# EAGLE design quantizer_main (EAGLE 6.6.0)
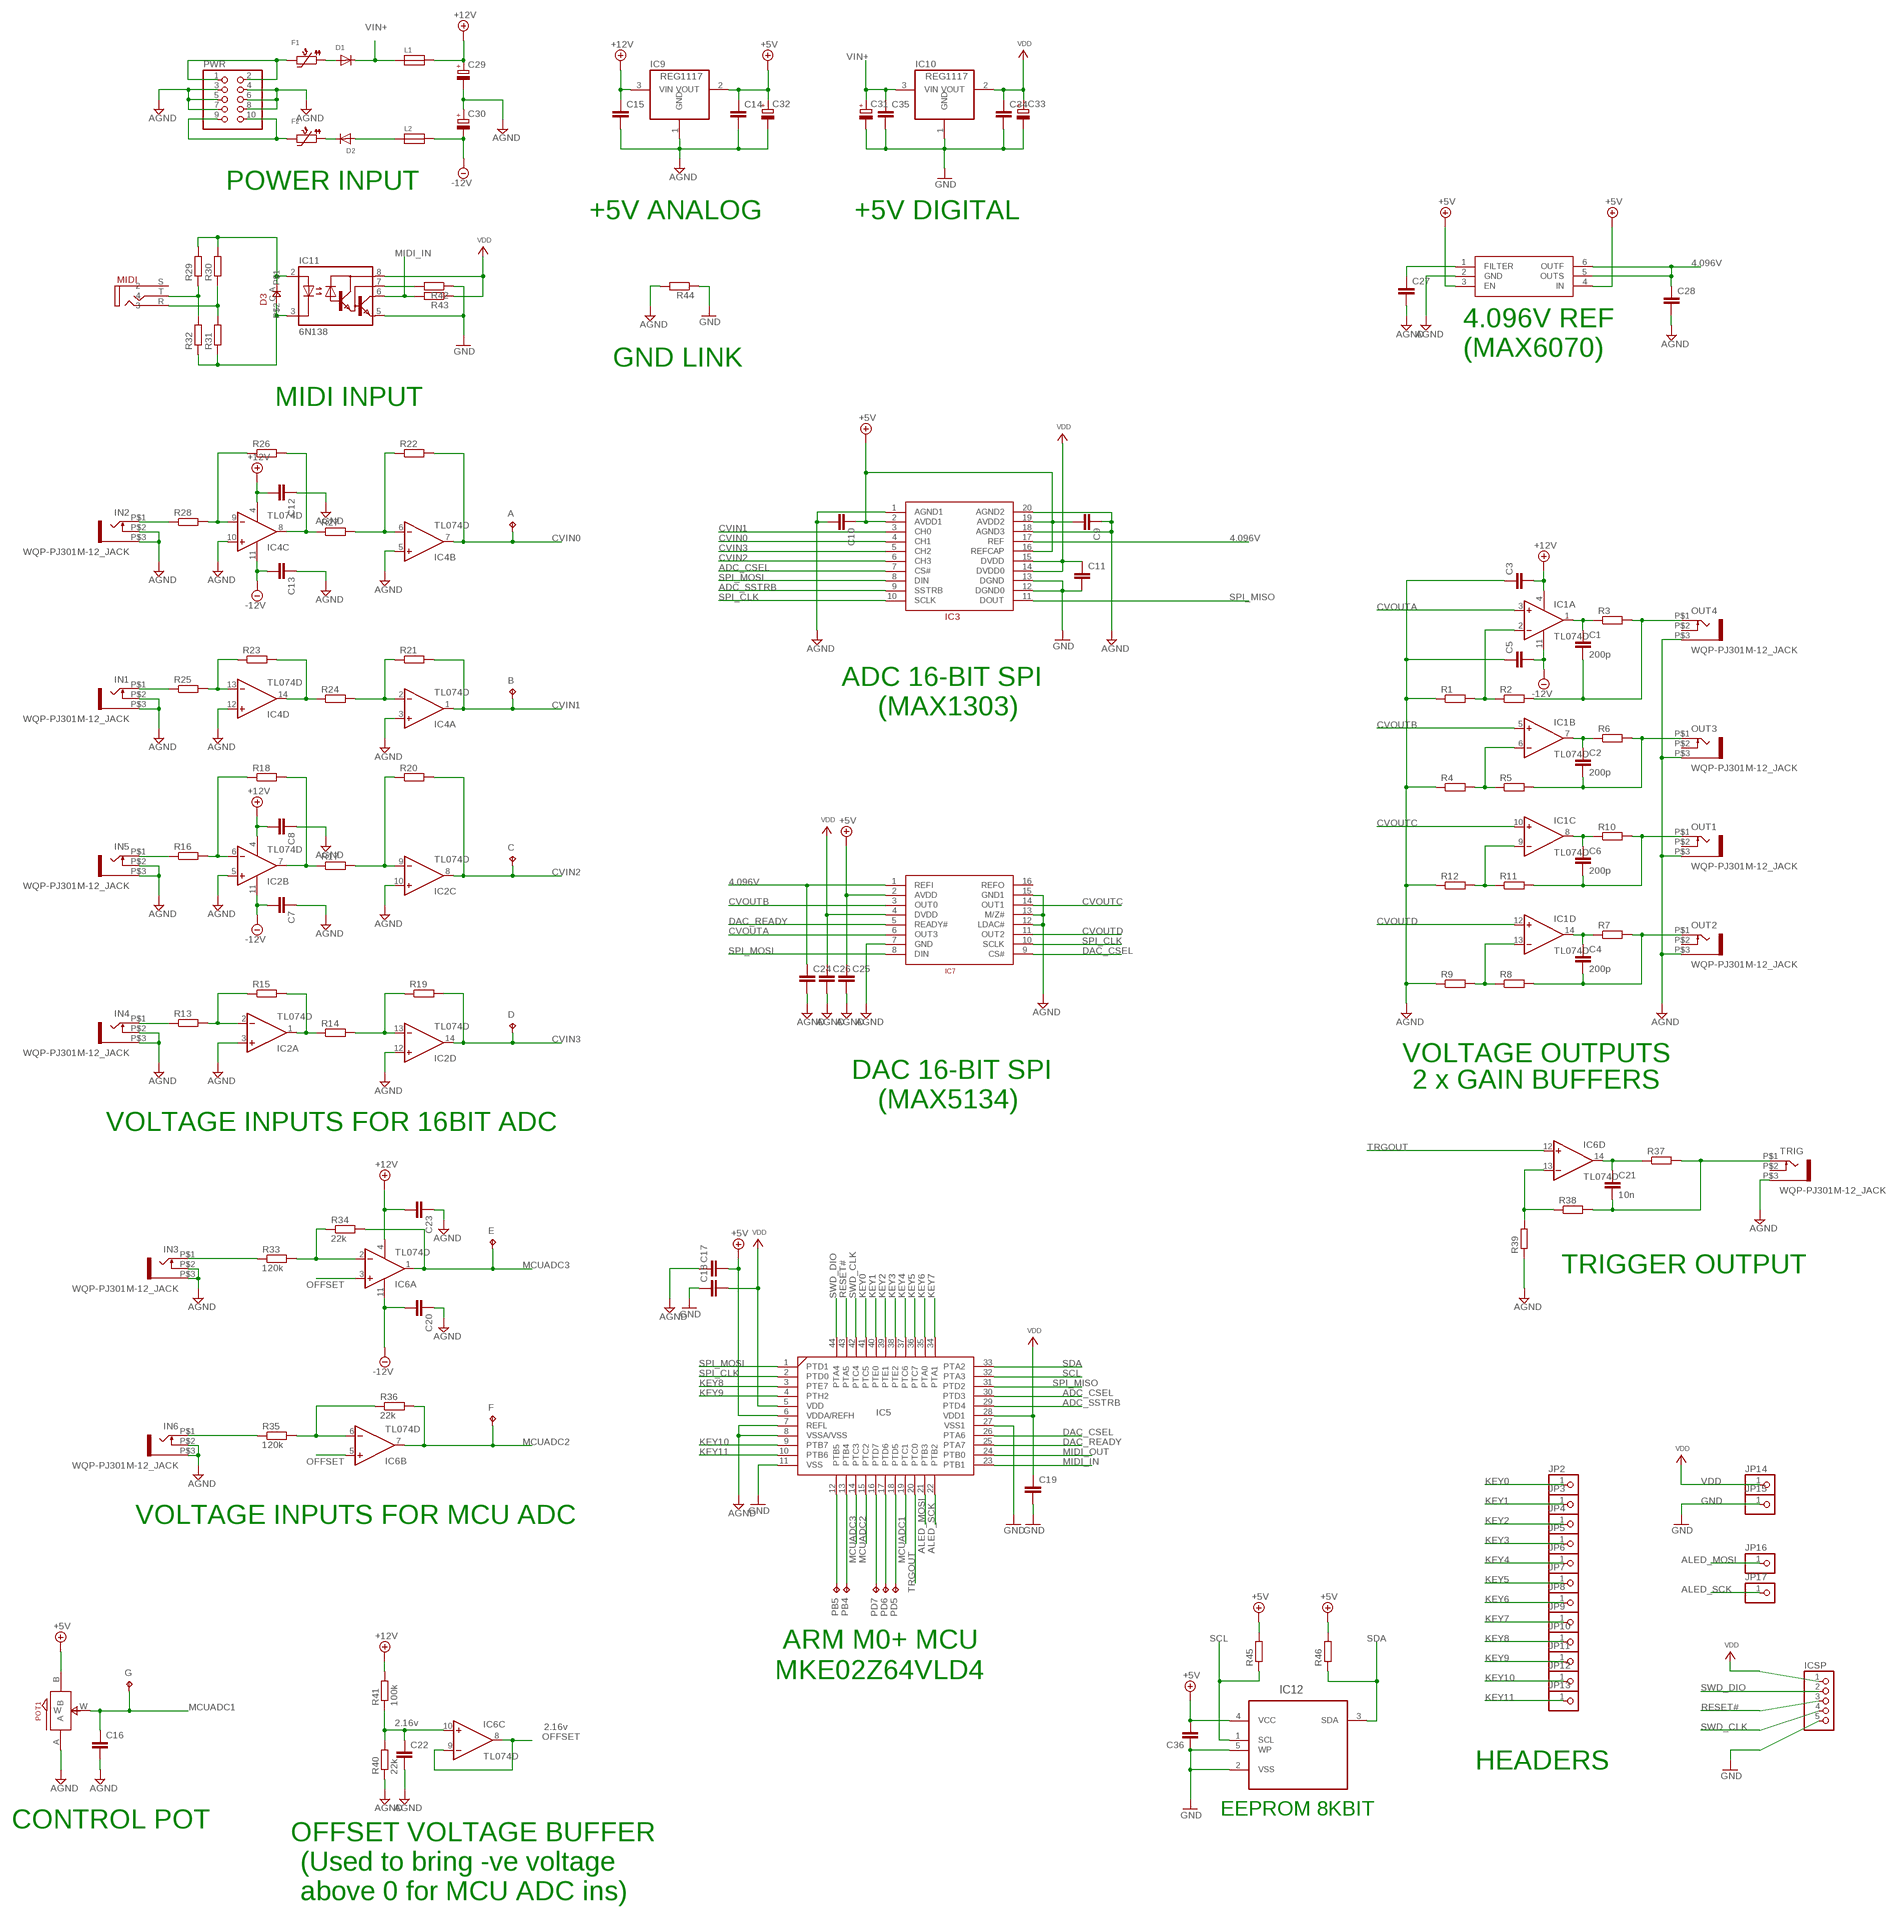
[diagram p0: schematic, sheet 1]

## Parts
A  TPB1,27  [B1,27]
B  TPB1,27  [B1,27]
C  TPB1,27  [B1,27]
C1  200p  C-EUC0805  [C0805]
C2  200p  C-EUC0805  [C0805]
C3  C-EUC0805  [C0805]
C4  200p  C-EUC0805  [C0805]
C5  C-EUC0805  [C0805]
C6  200p  C-EUC0805  [C0805]
C7  C-EUC0805  [C0805]
C8  C-EUC0805  [C0805]
C9  C-EUC0805  [C0805]
C10  C-EUC0805  [C0805]
C11  C-EUC0805  [C0805]
C12  C-EUC0805  [C0805]
C13  C-EUC0805  [C0805]
C14  C-EUC0805  [C0805]
C15  C-EUC0805  [C0805]
C16  C-EUC0805  [C0805]
C17  C-EUC0805  [C0805]
C18  C-EUC0805  [C0805]
C19  C-EUC0805  [C0805]
C20  C-EUC0805  [C0805]
C21  10n  C-EUC0805  [C0805]
C22  C-EUC0805  [C0805]
C23  C-EUC0805  [C0805]
C24  C-EUC0805  [C0805]
C25  C-EUC0805  [C0805]
C26  C-EUC0805  [C0805]
C27  C-EUC0805  [C0805]
C28  C-EUC0805  [C0805]
C29  CPOL-EUE2-5  [E2-5]
C30  CPOL-EUE2-5  [E2-5]
C31  CPOL-EUE2-5  [E2-5]
C32  CPOL-EUE2-5  [E2-5]
C33  CPOL-EUE2-5  [E2-5]
C34  C-EUC0805  [C0805]
C35  C-EUC0805  [C0805]
C36  C-EUC0805  [C0805]
D  TPB1,27  [B1,27]
D1  DIODESOD-123  [SOD-123]
D2  DIODESOD-123  [SOD-123]
D3  0805DIODE  [0805DIODE]
E  TPB1,27  [B1,27]
F  TPB1,27  [B1,27]
F1  PTC1206  [1206]
F2  PTC1206  [1206]
G  TPB1,27  [B1,27]
IC1  TL074D  [SO14]
IC2  TL074D  [SO14]
IC3  MAX1303_ADC  [TSSOP20]
IC4  TL074D  [SO14]
IC5  MKE02_44PIN  [TQFP44]
IC6  TL074D  [SO14]
IC7  MAX5134_DAC  [TSSOP16]
IC8  MAX6070  [SOT23-6]
IC9  REG1117  [SOT223]
IC10  REG1117  [SOT223]
IC11  6N138  [DIL08]
IC12  24LC_16BT-I/OT  [SOT95P290X145-5N]
ICSP  PINHD-1X5  [1X05]
IN1  WQP-PJ301M-12_JACK  [WQP-PJ301M-12_JACK]
IN2  WQP-PJ301M-12_JACK  [WQP-PJ301M-12_JACK]
IN3  WQP-PJ301M-12_JACK  [WQP-PJ301M-12_JACK]
IN4  WQP-PJ301M-12_JACK  [WQP-PJ301M-12_JACK]
IN5  WQP-PJ301M-12_JACK  [WQP-PJ301M-12_JACK]
IN6  WQP-PJ301M-12_JACK  [WQP-PJ301M-12_JACK]
JP2  PINHD-1X1  [1X01]
JP3  PINHD-1X1  [1X01]
JP4  PINHD-1X1  [1X01]
JP5  PINHD-1X1  [1X01]
JP6  PINHD-1X1  [1X01]
JP7  PINHD-1X1  [1X01]
JP8  PINHD-1X1  [1X01]
JP9  PINHD-1X1  [1X01]
JP10  PINHD-1X1  [1X01]
JP11  PINHD-1X1  [1X01]
JP12  PINHD-1X1  [1X01]
JP13  PINHD-1X1  [1X01]
JP14  PINHD-1X1  [1X01]
JP15  PINHD-1X1  [1X01]
JP16  PINHD-1X1  [1X01]
JP17  PINHD-1X1  [1X01]
L1  FERRITE  [0603]
L2  FERRITE  [0603]
MIDI  VERTICAL_3_5MM_SOCKETTHONK  [PJ301CM]
OUT1  WQP-PJ301M-12_JACK  [WQP-PJ301M-12_JACK]
OUT2  WQP-PJ301M-12_JACK  [WQP-PJ301M-12_JACK]
OUT3  WQP-PJ301M-12_JACK  [WQP-PJ301M-12_JACK]
OUT4  WQP-PJ301M-12_JACK  [WQP-PJ301M-12_JACK]
PB4  TPB1,27  [B1,27]
PB5  TPB1,27  [B1,27]
PD5  TPB1,27  [B1,27]
PD6  TPB1,27  [B1,27]
PD7  TPB1,27  [B1,27]
POT1  ALPS_POT_SMALL  [SMALL_ALPS_POT]
PWR  PINHD-2X5  [2X05]
R1  R-EU_R0805  [R0805]
R2  R-EU_R0805  [R0805]
R3  R-EU_R0805  [R0805]
R4  R-EU_R0805  [R0805]
R5  R-EU_R0805  [R0805]
R6  R-EU_R0805  [R0805]
R7  R-EU_R0805  [R0805]
R8  R-EU_R0805  [R0805]
R9  R-EU_R0805  [R0805]
R10  R-EU_R0805  [R0805]
R11  R-EU_R0805  [R0805]
R12  R-EU_R0805  [R0805]
R13  R-EU_R0805  [R0805]
R14  R-EU_R0805  [R0805]
R15  R-EU_R0805  [R0805]
R16  R-EU_R0805  [R0805]
R17  R-EU_R0805  [R0805]
R18  R-EU_R0805  [R0805]
R19  R-EU_R0805  [R0805]
R20  R-EU_R0805  [R0805]
R21  R-EU_R0805  [R0805]
R22  R-EU_R0805  [R0805]
R23  R-EU_R0805  [R0805]
R24  R-EU_R0805  [R0805]
R25  R-EU_R0805  [R0805]
R26  R-EU_R0805  [R0805]
R27  R-EU_R0805  [R0805]
R28  R-EU_R0805  [R0805]
R29  R-EU_R0805  [R0805]
R30  R-EU_R0805  [R0805]
R31  R-EU_R0805  [R0805]
R32  R-EU_R0805  [R0805]
R33  120k  R-EU_R0805  [R0805]
R34  22k  R-EU_R0805  [R0805]
R35  120k  R-EU_R0805  [R0805]
R36  22k  R-EU_R0805  [R0805]
R37  R-EU_R0805  [R0805]
R38  R-EU_R0805  [R0805]
R39  R-EU_R0805  [R0805]
R40  22k  R-EU_R0805  [R0805]
R41  100k  R-EU_R0805  [R0805]
R42  R-EU_R0805  [R0805]
R43  R-EU_R0805  [R0805]
R44  R-EU_R0805  [R0805]
R45  R-EU_R0805  [R0805]
R46  R-EU_R0805  [R0805]
TRIG  WQP-PJ301M-12_JACK  [WQP-PJ301M-12_JACK]

## Nets
4.096V: C24.1 C28.1 IC3.17(REF) IC7.1(REFI) IC8.5(OUTS) IC8.6(OUTF)
+5V: C9.2 C10.1 C14.1 C17.2 C25.1 C32.+ C36.2 IC3.2(AVDD1) IC3.16(REFCAP) IC3.19(AVDD2) IC5.6(VDDA/REFH) IC7.2(AVDD) IC8.3(EN) IC8.4(IN) IC9.2(VOUT) IC12.4(VCC) POT1.B R45.2 R46.2
+12V: C3.2 C8.2 C12.2 C15.1 C23.2 C29.+ IC1.4(P:V+) IC2.4(P:V+) IC4.4(P:V+) IC6.4(P:V+) IC9.3(VIN) L1.2 R41.2
-12V: C5.2 C7.2 C13.2 C20.2 C30.- IC1.11(P:V-) IC2.11(P:V-) IC4.11(P:V-) IC6.11(P:V-) L2.2
ADC_CSEL: IC3.7(CS#) IC5.30(PTD3)
ADC_SSTRB: IC3.9(SSTRB) IC5.29(PTD4)
AGND: C3.1 C5.1 C7.1 C8.1 C9.1 C10.2 C12.1 C13.1 C14.2 C15.2 C16.2 C17.1 C20.1 C22.2 C23.1 C24.2 C25.2 C26.2 C27.2 C28.2 C29.- C30.+ C32.- IC2.3(A:+IN) IC2.5(B:+IN) IC2.10(C:+IN) IC2.12(D:+IN) IC3.1(AGND1) IC3.18(AGND3) IC3.20(AGND2) IC4.3(A:+IN) IC4.5(B:+IN) IC4.10(C:+IN) IC4.12(D:+IN) IC5.7(REFL) IC5.8(VSSA/VSS) IC7.7(GND) IC7.12(LDAC#) IC7.13(M/Z#) IC7.15(GND1) IC8.2(GND) IC9.1(GND) IN1.P$2 IN1.P$3 IN2.P$2 IN2.P$3 IN3.P$2 IN3.P$3 IN4.P$2 IN4.P$3 IN5.P$2 IN5.P$3 IN6.P$2 IN6.P$3 OUT1.P$3 OUT2.P$3 OUT3.P$3 OUT4.P$3 POT1.A PWR.3 PWR.4 PWR.5 PWR.6 PWR.7 PWR.8 R1.1 R4.1 R9.1 R12.1 R39.1 R40.1 R44.2 TRIG.P$3
ALED_MOSI: IC5.21(PTB3) JP16.1
ALED_SCK: IC5.22(PTB2) JP17.1
CVIN0: A.TP IC3.4(CH1) IC4.7(B:OUT) R22.2
CVIN1: B.TP IC3.3(CH0) IC4.1(A:OUT) R21.2
CVIN2: C.TP IC2.8(C:OUT) IC3.6(CH3) R20.2
CVIN3: D.TP IC2.14(D:OUT) IC3.5(CH2) R19.2
CVOUTA: IC1.3(A:+IN) IC7.6(OUT3)
CVOUTB: IC1.5(B:+IN) IC7.3(OUT0)
CVOUTC: IC1.10(C:+IN) IC7.14(OUT1)
CVOUTD: IC1.12(D:+IN) IC7.11(OUT2)
DAC_CSEL: IC5.26(PTA6) IC7.9(CS#)
DAC_READY: IC5.25(PTA7) IC7.5(READY#)
GND: C11.2 C18.1 C19.2 C31.- C33.- C34.2 C35.2 C36.1 IC3.12(DGND0) IC3.13(DGND) IC5.11(VSS) IC5.27(VSS1) IC10.1(GND) IC11.5(GND) IC12.2(VSS) IC12.5(WP) ICSP.5 JP15.1 R42.1 R44.1
KEY0: IC5.41(PTC5) JP2.1
KEY1: IC5.40(PTE0) JP3.1
KEY2: IC5.39(PTE1) JP4.1
KEY3: IC5.38(PTE2) JP5.1
KEY4: IC5.37(PTC6) JP6.1
KEY5: IC5.36(PTC7) JP7.1
KEY6: IC5.35(PTA0) JP8.1
KEY7: IC5.34(PTA1) JP9.1
KEY8: IC5.3(PTE7) JP10.1
KEY9: IC5.4(PTH2) JP11.1
KEY10: IC5.9(PTB7) JP12.1
KEY11: IC5.10(PTB6) JP13.1
MCUADC1: C16.1 G.TP IC5.19(PTC1) POT1.W
MCUADC2: F.TP IC5.15(PTC2) IC6.7(B:OUT) R36.2
MCUADC3: E.TP IC5.14(PTC3) IC6.1(A:OUT) R34.2
MIDI_IN: IC5.23(PTB1) IC11.6(VO) R43.2
MIDI_OUT: IC5.24(PTB0)
N$1: IC1.2(A:-IN) R1.2 R2.1
N$2: C1.2 OUT4.P$1 R2.2 R3.2
N$3: D1.A F1.1
N$4: C1.1 IC1.1(A:OUT) R3.1
N$5: IN1.P$1 R25.1
N$6: IC1.6(B:-IN) R4.2 R5.1
N$7: C2.2 OUT3.P$1 R5.2 R6.2
N$8: C2.1 IC1.7(B:OUT) R6.1
N$9: D2.C F2.1
N$10: IN2.P$1 R28.1
N$11: IC1.9(C:-IN) R11.1 R12.2
N$12: C6.2 OUT1.P$1 R10.2 R11.2
N$13: C6.1 IC1.8(C:OUT) R10.1
N$14: F1.2 PWR.1 PWR.2
N$15: IC4.9(C:-IN) R26.1 R28.2
N$16: IC1.13(D:-IN) R8.1 R9.2
N$17: C4.2 OUT2.P$1 R7.2 R8.2
N$18: C4.1 IC1.14(D:OUT) R7.1
N$19: F2.2 PWR.9 PWR.10
N$20: IC4.8(C:OUT) R26.2 R27.1
N$21: IC4.6(B:-IN) R22.1 R27.2
N$22: IC5.12(PTB5) PB5.TP
N$23: IC11.7(VB) R42.2
N$24: MIDI.R R30.1 R31.2
N$25: IC4.13(D:-IN) R23.1 R25.2
N$26: IC4.14(D:OUT) R23.2 R24.1
N$27: IC4.2(A:-IN) R21.1 R24.2
N$28: MIDI.T R29.1 R32.2
N$29: D3.C IC11.3(C) R31.1 R32.1
N$30: IN5.P$1 R16.1
N$31: IC2.6(B:-IN) R16.2 R18.1
N$32: IC2.7(B:OUT) R17.1 R18.2
N$33: IC2.9(C:-IN) R17.2 R20.1
N$34: IC6.13(D:-IN) R38.1 R39.2
N$35: C21.1 IC6.14(D:OUT) R37.1
N$36: IN4.P$1 R13.1
N$37: IC2.2(A:-IN) R13.2 R15.1
N$38: IC2.1(A:OUT) R14.1 R15.2
N$39: IC2.13(D:-IN) R14.2 R19.1
N$40: C21.2 R37.2 R38.2 TRIG.P$1
N$41: D3.A IC11.2(A) R29.2 R30.2
N$42: C22.1 IC6.10(C:+IN) R40.2 R41.1
N$43: IC6.2(A:-IN) R33.2 R34.1
N$44: C27.1 IC8.1(FILTER)
N$45: IN3.P$1 R33.1
N$47: IC6.6(B:-IN) R35.2 R36.1
N$48: IC5.16(PTD7) PD7.TP
N$49: IN6.P$1 R35.1
N$51: IC5.17(PTD6) PD6.TP
N$52: IC5.18(PTD5) PD5.TP
N$58: IC5.13(PTB4) PB4.TP
OFFSET: IC6.3(A:+IN) IC6.5(B:+IN) IC6.8(C:OUT) IC6.9(C:-IN)
RESET#: IC5.43(PTA5) ICSP.3
SCL: IC5.32(PTA3) IC12.1(SCL) R45.1
SDA: IC5.33(PTA2) IC12.3(SDA) R46.1
SPI_CLK: IC3.10(SCLK) IC5.2(PTD0) IC7.10(SCLK)
SPI_MISO: IC3.11(DOUT) IC5.31(PTD2)
SPI_MOSI: IC3.8(DIN) IC5.1(PTD1) IC7.8(DIN)
SWD_CLK: IC5.42(PTC4) ICSP.4
SWD_DIO: IC5.44(PTA4) ICSP.2
TRGOUT: IC5.20(PTC0) IC6.12(D:+IN)
VDD: C11.1 C18.2 C19.1 C26.1 C33.+ C34.1 IC3.14(DVDD0) IC3.15(DVDD) IC5.5(VDD) IC5.28(VDD1) IC7.4(DVDD) IC10.2(VOUT) IC11.8(VCC) ICSP.1 JP14.1 R43.1
VIN+: C31.+ C35.1 D1.C IC10.3(VIN) L1.1
VIN-: D2.A L2.1
Unconnected: IC7.16(REFO) MIDI.S OUT1.P$2 OUT2.P$2 OUT3.P$2 OUT4.P$2 TRIG.P$2

## Notes on the sheet
- POWER INPUT
- +5V ANALOG | +5V DIGITAL
- 4.096V REF
- (MAX6070)
- GND LINK
- MIDI INPUT
- ADC 16-BIT SPI
- (MAX1303)
- VOLTAGE OUTPUTS
- DAC 16-BIT SPI
- 2 x GAIN BUFFERS
- (MAX5134)
- VOLTAGE INPUTS FOR 16BIT ADC
- TRIGGER OUTPUT
- VOLTAGE INPUTS FOR MCU ADC
- ARM M0+ MCU
- MKE02Z64VLD4
- 2.16v
- 2.16v
- HEADERS
- EEPROM 8KBIT
- CONTROL POT
- OFFSET VOLTAGE BUFFER
- (Used to bring -ve voltage 
  above 0 for MCU ADC ins)

## Library data of the parts
A B C D E F G PB4 PB5 PD5-PD7 = testpad:TP: Test pad
C1-C28 C34 C35 = rcl:C-EU: CAPACITOR, European symbol
C29-C33 = rcl:CPOL-EU: POLARIZED CAPACITOR, European symbol
C36 = resistor:C-EU: CAPACITOR, European symbol
D1 D2 = microbuilder:DIODE: Diode SMADIODE - SMA Surface Mount Package 20V 1A Schottky Diode Digikey (500mV @ 1A, 500uA Vr @ 20V): 641-1014-6-ND 10V 2A Schottky Diode Digikey (350mV @ 2A, 700uA Vr @ 10V): MBRA210LT3 SOD-123 30V 200mA (800mV Vf, 2uA Vr @ 25V) Schottky Diode (very fast switching for boost, etc.) - Digikey: BAT54T1GOSTR-ND 30V 500mA (430mV Vf, 130uA Vr @ 30V) Schottky Diode - Digikey: B0530W-FDICT-ND MBR120 1A 20V (0.34Vf) Schottky Diode - Digikey: MBR120VLSFT1GOSCT-ND SOD-323 10V 570mA (380mV Vf, 3ns) Schottky Diode - Digikey: ZLLS410CT-ND 1N4148WS - 75V 150mA (1V Vf @ 10mA, 4ns) Simple Diode - Digikey: 1N4148WSFSCT-ND, Mouser: 512-1N4148WS SOD-523 BAT54 30V 200mA Schottky (0.8 Vf @ 100mA, 5ns) - Digikey: BAT54XV2CT-ND 30V 30mA Schottky Diode (RB751S-40TE61) - Digikey: RB751S-40TE61CT-ND SOT23-R/W - SOT23 Package (R = Solder Paste/Reflow Ovens, W = Hand-Soldering) BAT54Film 40V 300mA - Digikey: 497-7162-1-ND DO-1N4148 Through Hole Small Current Diode (any model)
D3 = jasons_stuff:0805DIODE
F1 F2 = microbuilder:PTC: PTC (Resettable Fuse) 1206 Package 250mA PTC (16V Max, Time-to-Trip: 0.08s) - Digikey: F2110CT-ND 1210 Package 100mA PTC (30V Max, Time-to-Trip: 0.6s) - Digikey: MF-USMF010-2CT-ND 1812 Package 750mA PTC (24V Max, Time-to-Trip: 0.2s) - Digikey: MF-MSMF075/24-2CT-ND
IC1 IC2 IC4 IC6 = linear:TL074: OP AMP
IC3 = jason_eagle6:MAX1303_ADC
IC5 = jason_eagle6:MKE02_44PIN
IC7 = jason_eagle6:MAX5134_DAC
IC8 = jason_eagle6:MAX6070
IC9 IC10 = burr-brown:REG1117: 800mA and 1A Low Dropout (LDO) Positive Regulator 1.8V, 2.5V, 2.85V, 3.3V, 5V, and Adj; MPN: REG1117; OC_FARNELL: 1097566; OC_NEWARK: 14P6981
IC11 = optocoupler:6N138: MOTOROLA OPTO COUPLER; MF: VISHAY/TELEFUNKEN; MPN: 6N138; OC_FARNELL: 9860150; OC_NEWARK: 35K5294
IC12 = Microchip-24LCxxx:24LC_: IC, I2C Serial EEPROM,SOT-23-5; MPN: 24LC16BT-I/OT; OC_FARNELL: 9757961; OC_NEWARK: 62K0580; PACKAGE: SOT-23-5; SUPPLIER: MICROCHIP
ICSP = pinhead:PINHD-1X5: PIN HEADER
IN1-IN6 OUT1-OUT4 TRIG = thonkiconn:WQP-PJ301M-12_JACK
JP2-JP17 = pinhead:PINHD-1X1: PIN HEADER
L1 L2 = microbuilder:FERRITE: Ferrite Bead 0603 MMZ1608B121C - 120 Ohm, 600mA Ferrite Chip - Digikey: 445-2164-1-ND BK1608HW121-T - 120 Ohm, 600mA Ferrite Chip - Digikey: 587-1876-2-ND
MIDI = jason_eagle6:VERTICAL_3_5MM_SOCKET
POT1 = jasons_stuff:ALPS_POT_SMALL
PWR = pinhead:PINHD-2X5: PIN HEADER
R1-R46 = rcl:R-EU_: RESISTOR, European symbol

## Board
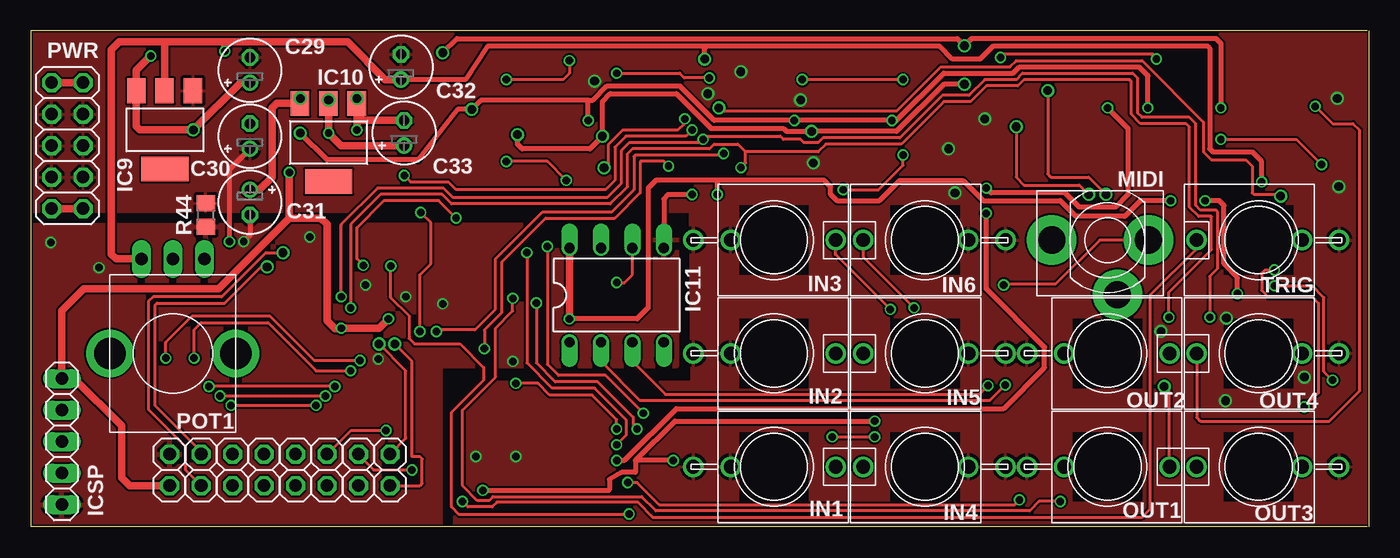
[diagram p1: board, top side]
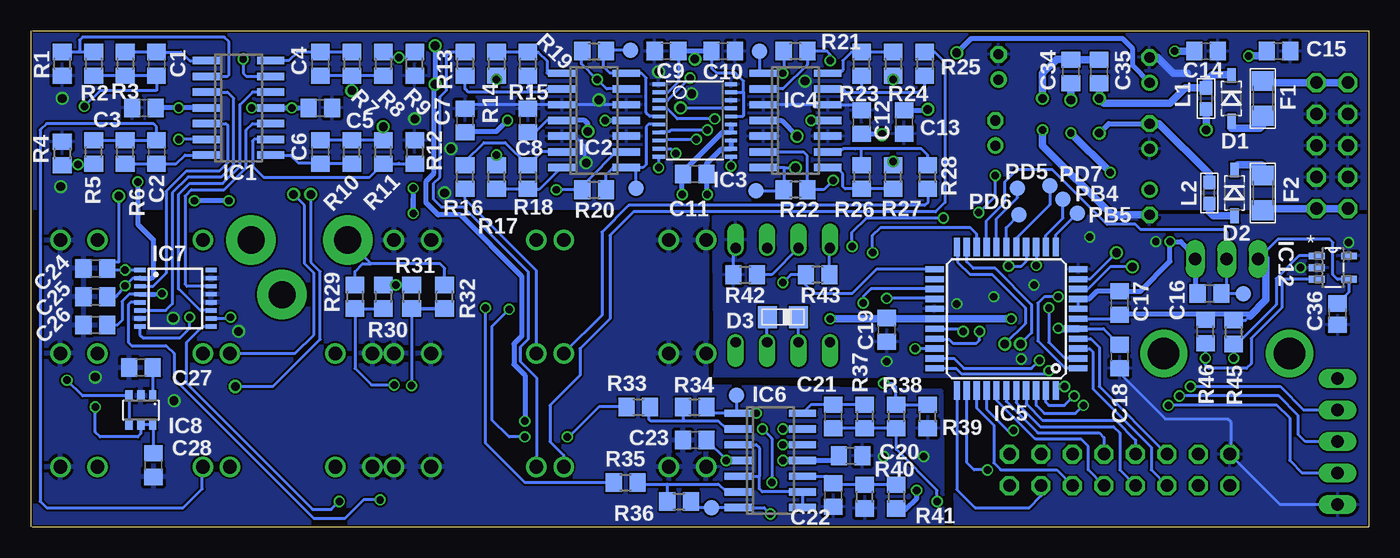
[diagram p2: board, bottom side, seen from below]

Size 107.95 x 39.98 mm. Coordinates in mm from the lower left corner, seen from the top.
Outline: 107.84,39.98 0,39.98 0,0 107.84,0
Outline: 107.95,39.98 107.95,0
Copper layers (1*16): Top 0.035mm / dielectric 1.5mm / Bottom 0.035mm
Design rules "hackvana": minimum track width 6mil, minimum drill 0.3mm, track to track 6mil, track to pad 9mil, pad to pad 6mil, via to via 6mil, smd to smd 0mil, copper to edge 6mil, drill to drill 6mil, minimum pad ring 10mil, minimum via ring 6mil, stop-mask expansion 2mil, vias tented up to drill 100mil, thermal gap 10mil

### Footprints (pad centres in the part's own frame; a part is rotated, then mirrored left to right if it is on the bottom)
B1,27 = smd 1.27 x 1.27: TP 0,0
C0805 = smd 1.3 x 1.5: 1 -0.95,0; 2 0.95,0
E2-5 = drill 0.813 pad 1.27: + -1.016,0 | drill 0.813 pad 1.27 octagon: - 1.016,0
C0805' = smd 1.3 x 1.5: 1 -0.85,0; 2 0.85,0
SOD-123 = smd 1.2 x 0.7: A 1.85,0; C -1.85,0
0805DIODE = smd 1.524 x 1.778: A -1.262,-0.005; C 1.238,-0.005
1206 = smd 1.6 x 1.8: 1 -1.4,0; 2 1.4,0
SO14 = smd 0.6 x 2.2: 1 -3.81,-2.6; 2 -2.54,-2.6; 3 -1.27,-2.6; 4 0,-2.6; 5 1.27,-2.6; 6 2.54,-2.6; 7 3.81,-2.6; 8 3.81,2.6; 9 2.54,2.6; 10 1.27,2.6; 11 0,2.6; 12 -1.27,2.6; 13 -2.54,2.6; 14 -3.81,2.6
TSSOP20 = smd 0.305 x 0.991: 1 -2.925,-2.918; 2 -2.275,-2.918; 3 -1.625,-2.918; 4 -0.975,-2.918; 5 -0.325,-2.918; 6 0.325,-2.918; 7 0.975,-2.918; 8 1.625,-2.918; 9 2.275,-2.918; 10 2.925,-2.918; 11 2.925,2.918; 12 2.275,2.918; 13 1.625,2.918; 14 0.975,2.918; 15 0.325,2.918; 16 -0.325,2.918; 17 -0.975,2.918; 18 -1.625,2.918; 19 -2.275,2.918; 20 -2.925,2.918
TQFP44 = smd 1.5 x 0.5: 1 -5.8,4; 2 -5.8,3.2; 3 -5.8,2.4; 4 -5.8,1.6; 5 -5.8,0.8; 6 -5.8,0; 7 -5.8,-0.8; 8 -5.8,-1.6; 9 -5.8,-2.4; 10 -5.8,-3.2; 11 -5.8,-4; 23 5.8,-4; 24 5.8,-3.2; 25 5.8,-2.4; 26 5.8,-1.6; 27 5.8,-0.8; 28 5.8,0; 29 5.8,0.8; 30 5.8,1.6; 31 5.8,2.4; 32 5.8,3.2; 33 5.8,4 | smd 0.5 x 1.5: 12 -4,-5.8; 13 -3.2,-5.8; 14 -2.4,-5.8; 15 -1.6,-5.8; 16 -0.8,-5.8; 17 0,-5.8; 18 0.8,-5.8; 19 1.6,-5.8; 20 2.4,-5.8; 21 3.2,-5.8; 22 4,-5.8; 34 4,5.8; 35 3.2,5.8; 36 2.4,5.8; 37 1.6,5.8; 38 0.8,5.8; 39 0,5.8; 40 -0.8,5.8; 41 -1.6,5.8; 42 -2.4,5.8; 43 -3.2,5.8; 44 -4,5.8
TSSOP16 = smd 0.9 x 0.35: 1 -2.875,2.275; 2 -2.875,1.625; 3 -2.875,0.975; 4 -2.875,0.325; 5 -2.875,-0.325; 6 -2.875,-0.975; 7 -2.875,-1.625; 8 -2.875,-2.275; 9 2.875,-2.275; 10 2.875,-1.625; 11 2.875,-0.975; 12 2.875,-0.325; 13 2.875,0.325; 14 2.875,0.975; 15 2.875,1.625; 16 2.875,2.275
SOT23-6 = smd 0.6 x 0.9: 1 -0.95,-1.15; 2 0,-1.15; 3 0.95,-1.15; 4 0.95,1.15; 5 0,1.15; 6 -0.95,1.15
SOT223 = smd 1.499 x 2.007: 1 -2.261,-3.15; 2 0.025,-3.15; 3 2.311,-3.15 | smd 3.81 x 2.007: 4 0,3.15
DIL08 = drill 0.813 offset: 1 -3.81,-3.81; 2 -1.27,-3.81; 3 1.27,-3.81; 4 3.81,-3.81; 5 3.81,3.81; 6 1.27,3.81; 7 -1.27,3.81; 8 -3.81,3.81
SOT95P290X145-5N = smd 1.27 x 0.559: 1 -1.295,0.94; 2 -1.295,0; 3 -1.295,-0.94; 4 1.295,-0.94; 5 1.295,0.94
1X05 = drill 1.016 long: 1 -5.08,0; 2 -2.54,0; 3 0,0; 4 2.54,0; 5 5.08,0
WQP-PJ301M-12_JACK = drill 1.1: P$1 0,5; P$2 0,-3.5; P$3 0,-6.5
1X01 = drill 1.016 octagon: 1 0,0
0603 = smd 1.1 x 1: 1 -0.85,0; 2 0.85,0
PJ301CM = drill 2.2 pad 4: R 0,3.3; S 4.4,0.8; T 0,-4.5
SMALL_ALPS_POT = drill 1.016 long: A -2.54,-7.62; B 2.54,-7.62; W 0,-7.62 | drill 2.54 pad 3.81: GND@1 -5.08,0; GND@2 5.08,0
2X05 = drill 1.016 octagon: 1 -5.08,-1.27; 2 -5.08,1.27; 3 -2.54,-1.27; 4 -2.54,1.27; 5 0,-1.27; 6 0,1.27; 7 2.54,-1.27; 8 2.54,1.27; 9 5.08,-1.27; 10 5.08,1.27
R0805 = smd 1.3 x 1.5: 1 -0.95,0; 2 0.95,0

### Placement (x,y rotation side)
A  49.42,27.11 0 bottom
B  49.17,38.35 0 bottom
C  59.14,27.3 0 bottom
C1  97.81,37.34 270 bottom
C2  97.81,30.23 90 bottom
C3  98.82,33.78 0 bottom
C4  84.6,37.34 270 bottom
C5  84.6,33.78 180 bottom
C6  84.6,30.23 90 bottom
C7  72.92,32.77 270 bottom
C8  67.84,32.77 270 bottom
C9  56.66,38.35 0 bottom
C10  52.09,38.35 0 bottom
C11  54.37,28.45 0 bottom
C12  40.91,32.64 270 bottom
C13  37.48,32.64 90 bottom
C14  13.1,38.35 0 bottom
C15  7.26,38.35 0 bottom
C16  12.85,18.8 180 bottom
C17  20.08,18.03 270 bottom
C18  20.08,13.72 90 bottom
C19  38.88,15.88 270 bottom
C20  41.8,5.72 180 bottom
C21  43.2,8.89 270 bottom
C22  43.2,2.54 270 bottom
C23  54.37,6.99 0 bottom
C24  102.76,20.83 180 bottom
C25  102.76,18.54 180 bottom
C26  102.76,16.26 180 bottom
C27  99.08,12.83 180 bottom
C28  98.06,4.95 270 bottom
C29  17.67,36.83 90 top
C30  17.67,31.5 90 top
C31  17.67,26.16 270 top
C32  29.86,37.08 90 top
C33  30.12,31.75 90 top
C34  24.02,36.7 90 bottom
C35  21.74,36.7 90 bottom
C36  [C0805']  2.49,17.14 90 bottom
D  59.58,38.42 0 bottom
D1  11.07,34.54 270 bottom
D2  10.81,26.92 270 bottom
D3  47.26,16.89 180 bottom
E  51.01,10.6 0 bottom
F  53.04,1.52 0 bottom
F1  8.53,34.54 90 bottom
F2  8.53,26.92 270 bottom
G  10.11,18.8 0 bottom
IC1  91.2,33.78 270 bottom
IC2  62.5,32.77 270 bottom
IC3  54.37,32.77 270 bottom
IC4  46.25,32.77 270 bottom
IC5  29.23,16.76 180 bottom
IC6  48.28,5.33 270 bottom
IC7  96.28,18.41 0 bottom
IC8  99.08,9.4 180 bottom
IC9  10.81,32 180 top
IC10  24.02,30.99 180 top
IC11  47.26,18.67 0 top
IC12  2.88,20.89 0 bottom
ICSP  2.49,6.86 270 top
IN1  59.96,4.83 270 top
IN2  59.96,13.97 270 top
IN3  59.96,23.11 270 top
IN4  72.15,4.83 90 top
IN5  72.15,13.97 90 top
IN6  72.15,23.11 90 top
JP2  18.81,5.84 90 top
JP3  18.81,3.3 90 top
JP4  21.35,5.84 90 top
JP5  21.35,3.3 90 top
JP6  23.89,5.84 90 top
JP7  23.89,3.3 90 top
JP8  26.43,5.84 90 top
JP9  26.43,3.3 90 top
JP10  16.27,3.3 90 top
JP11  16.27,5.84 90 top
JP12  13.73,5.84 90 top
JP13  13.73,3.3 90 top
JP14  11.19,3.3 90 top
JP15  11.19,5.84 90 top
JP16  28.97,5.84 90 top
JP17  28.97,3.3 90 top
L1  13.1,34.54 270 bottom
L2  12.85,26.92 90 bottom
MIDI  86.89,23.11 270 top
OUT1  86.89,4.83 270 top
OUT2  86.89,13.97 270 top
OUT3  99.08,4.83 90 top
OUT4  99.08,13.97 90 top
PB4  24.66,26.42 0 bottom
PB5  23.51,25.27 90 bottom
PD5  28.34,27.3 90 bottom
PD6  28.21,25.15 90 bottom
PD7  25.74,27.5 90 bottom
POT1  11.45,13.97 180 top
PWR  2.94,30.73 270 top
R1  105.43,37.34 90 bottom
R2  102.89,37.34 270 bottom
R3  100.35,37.34 270 bottom
R4  105.43,30.1 270 bottom
R5  102.89,30.23 90 bottom
R6  100.35,30.23 90 bottom
R7  82.06,37.34 270 bottom
R8  79.52,37.34 270 bottom
R9  76.98,37.34 90 bottom
R10  82.06,30.23 90 bottom
R11  79.52,30.23 90 bottom
R12  76.98,30.23 270 bottom
R13  72.92,37.34 270 bottom
R14  70.38,37.34 270 bottom
R15  67.84,37.34 90 bottom
R16  72.92,28.19 90 bottom
R17  70.38,28.19 90 bottom
R18  67.84,28.19 270 bottom
R19  62.5,38.35 0 bottom
R20  62.5,27.18 0 bottom
R21  46.25,38.35 180 bottom
R22  46.25,27.18 180 bottom
R23  40.91,37.34 90 bottom
R24  38.37,37.34 270 bottom
R25  35.83,37.34 270 bottom
R26  40.91,28.19 270 bottom
R27  38.37,28.19 90 bottom
R28  35.58,28.19 90 bottom
R29  81.81,18.54 270 bottom
R30  79.52,18.54 270 bottom
R31  77.23,18.54 90 bottom
R32  74.57,18.54 90 bottom
R33  58.95,9.65 0 bottom
R34  54.37,9.65 0 bottom
R35  59.96,3.56 0 bottom
R36  55.64,2.03 0 bottom
R37  40.66,8.89 270 bottom
R38  38.12,8.89 270 bottom
R39  35.58,8.89 90 bottom
R40  40.66,2.41 90 bottom
R41  38.12,2.41 270 bottom
R42  50.31,20.32 0 bottom
R43  44.47,20.32 180 bottom
R44  14.12,25.15 90 top
R45  10.88,15.68 90 bottom
R46  13.16,15.75 90 bottom
TRIG  99.08,23.11 90 top

### Tracks (layer width: path | path; a pad name or v marks a point on that pad's centre or on a via)
4.096V  (via drill 0.6, 0.7)
  Top 0.254: v100.35,20.7 99.59,20.7 99.33,20.45 99.33,19.05 99.84,18.54 103.4,18.54 103.9,18.03 103.9,10.8 v102.76,9.65 | v100.86,26.67 100.73,26.8 98.7,26.8 98.57,26.92 98.57,29.08 98.06,29.59 95.27,29.59 94.63,30.23 94.63,32.64 89.68,37.59 79.52,37.59 79.01,37.08 73.42,37.08 69.87,33.53 55.77,33.53 v55.52,33.78
  Bottom 0.254: v100.35,20.7 100.21,20.69 IC7.1 101.67,20.69 C24.1 101.3,21.34 100.86,21.34 v100.86,26.67 | IC8.6 | C28.1 98.06,8.18 IC8.6 | IC8.6 IC8.5 99.08,7.49 99.33,7.24 102.38,7.24 102.76,7.62 v102.76,9.65 | IC3.17 55.48,33.74 v55.52,33.78
+5V  (via drill 0.6, 0.7)
  Top 0.254: v100.35,19.43 103.4,19.43 104.35,18.48 104.35,12.51 v105.05,11.81
  Top 0.406: v99.33,27.81 99.33,29.46 98.57,30.23 95.4,30.23 95.14,30.48 95.14,38.61 95.01,38.73 77.62,38.73 76.6,37.72 74.38,37.72 73.36,38.73 54.5,38.73 | v54.37,37.72 54.37,38.61 54.5,38.73 | 54.5,38.73 36.85,38.73 35.07,36.07 C32.+
  Top 0.61: C32.+ 28.59,36.07 25.55,39.12 15.77,39.12 | IC9.2 10.79,39.01 10.69,39.12 | 15.77,39.12 10.69,39.12 | 10.69,39.12 7.13,39.12 6.5,38.48 6.5,21.97 6.88,21.59 POT1.B | v15.64,38.35 15.64,38.99 15.77,39.12
  Bottom 0.254: IC3.19 50.45,35.04 50.44,35.05 | 50.44,35.05 50.44,33.15 50.49,33.09 IC3.16 | C25.1 101.11,18.54 v100.35,19.43 99.74,20.04 IC7.2 | IC8.4 IC8.3 103.78,10.55 v105.05,11.81 | IC3.2 56.54,35.04 55.64,35.94 55.64,38.29 C9.2 | 50.44,35.05 50.44,35.94 51.07,36.58 52.6,36.58 52.98,36.96 52.98,38.29 C10.1 | IC5.6 20.4,16.76 C17.2 | C36.2 1.58,18.91 IC12.4 2.51,19.95 2.88,20.32 2.88,22.92 3.13,23.18 7.32,23.18 POT1.B | R45.2 9.93,16.63 9.58,16.99 9.42,17.14 | R46.2 13.16,17.02 13.04,17.14
  Bottom 0.305: C17.2 19.9,17.08 19.58,16.76
  Bottom 0.406: IC7.2 98.22,20.04 98.06,20.19 98.06,23.11 99.33,24.38 v99.33,27.81 | C10.1 54.37,38.35 | 54.37,38.35 C9.2 | v54.37,37.72 54.37,38.35 | 9.42,17.14 13.04,17.14 19.84,17.14 19.9,17.08
  Bottom 0.61: C14.1 v15.64,38.35 | C17.2 20.08,16.89 | POT1.B 8.34,21.59 8.27,21.65 8.27,18.29 9.58,16.99
+12V  (via drill 0.6, 0.7)
  Top 0.406: v96.03,33.78 96.03,38.99 95.65,39.37 75.9,39.37 v75.33,38.8 74.76,39.37 34.37,39.37 v33.23,38.23 | v39.26,31.62 39.26,30.86 39.64,30.48 45.1,30.48 v46.12,31.5 46.12,34.29 46.75,34.92 52.09,34.92 54.88,32.13 60.72,32.13 60.98,31.88 v63.01,31.88 69.87,31.88 73.68,35.69 v75.33,35.69 | v68.09,8.51 51.96,8.51 48.79,5.33 | v36.47,2.92 46.63,2.92 46.69,2.99 46.69,3.81 47.64,4.38 48.79,4.38 48.79,5.33 | v51.83,5.33 48.79,5.33
  Top 0.61: C29.+ 16.91,35.81 v13.1,32 8.78,32 8.5,32.28 IC9.3 8.5,36.8 v9.67,37.97
  Bottom 0.254: IC2.4 66.31,32.77 67.07,32 67.65,32 C8.2 | 38.06,1.52 R41.2 38.05,1.4 | IC6.4 51.77,5.33 C23.2
  Bottom 0.406: C3.2 v96.03,33.78 IC1.4 | C29.+ 19.07,37.21 19.07,38.61 19.83,39.37 32.09,39.37 v33.23,38.23 | IC4.4 47.39,32.77 v46.12,31.5 | C12.2 39.33,31.69 v39.26,31.62 | v75.33,38.8 v75.33,35.69 75.46,35.56 75.46,28.45 76.09,27.81 76.09,26.16 75.08,25.15 73.3,25.15 68.34,20.19 68.34,15.37 68.98,14.73 68.98,13.08 68.09,12.19 v68.09,8.51 | v63.01,31.88 63.01,32.51 63.26,32.77 IC2.4 | IC6.4 v51.83,5.33 | 38.05,1.4 37.36,1.4 36.47,2.29 v36.47,2.92
  Bottom 0.61: L1.2 v13.1,32 | C15.1 8.21,38.04 8.27,37.97 v9.67,37.97
-12V  (via drill 0.6, 0.7)
  Top 0.406: v90.14,33.78 90.14,36.37 89.43,37.08 79.77,37.08 79.27,36.58 73.68,36.58 69.87,32.77 v69.49,32.77 v61.61,32.77 55.14,32.77 52.34,35.56 46.5,35.56 45.36,34.42 44.98,34.42 | v21.74,31.75 23.89,29.59 31.26,29.59 34.44,33.66 v35.58,33.66 36.34,34.42 44.98,34.42 | v44.98,32.77 44.98,34.42 | v77.11,25.27 77.11,19.18 81.81,14.48 81.81,12.83 78.5,9.53 52.09,9.53 47.9,5.33 v47.26,5.33 | v86.9,33.78 86.9,33.77 88.54,32.13 88.54,26.8 87.52,25.78 84.6,25.78 83.46,26.92 77.49,26.92 v77.11,27.3
  Bottom 0.254: 72.86,31.88 C7.2
  Bottom 0.406: C20.2 43.13,5.33 IC6.11 v47.26,5.33 | 72.86,31.88 70.38,31.88 v69.49,32.77 | v61.61,32.77 IC2.11 | C5.2 v86.9,33.78 IC1.11 v90.14,33.78 | v21.74,31.75 20.97,32.51 C30.- | v44.98,32.77 IC4.11 | C13.2 35.64,33.59 v35.58,33.66 | v77.11,27.3 v77.11,25.27 77.11,26.54
  Bottom 0.61: C30.- 16.91,32.51 12.85,28.45 L2.2
ADC_CSEL  (via drill 0.6)
  Top 0.254: v53.36,32 52.85,31.5 48.02,31.5 47.14,30.61 47.14,27.94 46.37,27.18 34.31,27.18 33.67,27.81 30.63,27.81 v30.12,28.32 | v31.39,15.75 31.39,20.32 32.28,21.21 32.28,24.51 v31.45,25.34
  Bottom 0.254: IC5.30 34.98,15.11 33.86,15.11 33.55,14.8 31.64,14.8 31.39,15.05 v31.39,15.75 | IC3.7 57.21,31.88 56.41,31.88 56.28,32 v53.36,32 | v30.12,28.32 30.12,26.67 v31.45,25.34
ADC_SSTRB  (via drill 0.6)
  Top 0.254: v55.9,30.1 55.77,29.97 48.79,29.97 48.66,29.84 48.66,27.18 46.88,25.4 41.29,25.4 37.48,21.59 37.48,17.53 35.83,15.88 32.85,15.88 v32.72,15.75
  Bottom 0.254: 34.94,15.88 IC5.29 32.94,15.96 v32.72,15.75 | IC3.9 57.28,30.48 56.28,30.48 v55.9,30.1
AGND  (via drill 0.6, 0.7)
  Top 0.406: v16.02,22.99 16.02,28.83 C30.+
  Bottom 0.254: 41.23,34.04 IC4.12 IC4.3 | C7.1 72.6,34.04 68.09,34.04 67.84,33.78 C8.1 67.52,34.04 IC2.3 62.5,34.04 | IC2.12 62.5,34.04 | 62.49,34.02 62.5,34.04 | IC5.7 IC5.8 | IC2.5 64.03,31.5 63.26,30.73 63.26,29.46 v63.14,29.34 | C16.2 13.99,18.8
  Bottom 0.406: IC5.8 22.55,18.36 21.93,18.98 C17.1 18.44,18.98 16.02,21.4 v16.02,22.99 15.13,22.99 13.99,21.84 POT1.A 13.99,18.99 C16.2
  Bottom 0.61: C29.- 17.04,37.85 15.77,36.58 14.62,36.58
  other vias: 57.3,36.7 62.12,34.42 54.63,34.92 45.48,35.94 105.56,27.43 105.43,34.54 96.41,10.16 102.76,12.06 96.47,16.83 76.98,32.89 74.06,30.48 91.2,15.75 74.57,26.92 39.13,5.65 35.9,5.65
  pour Bottom: -1.12,40.01 -1.25,25.65 107.84,25.65 107.97,40.01
  pour Bottom: 34.31,0.19 34.37,10.48 34.44,10.99 63.52,11.56 63.71,-0.13
  pour Bottom: 107.84,0 53.49,0.06 53.36,29.46 104.09,29.34 107.9,29.4 107.97,0.19
  pour Top: 34.31,11.68 53.36,11.68 53.23,25.4 -1.38,25.4 -1.51,40.01 107.97,39.94 107.97,-0.13 34.18,-0.06
ALED_MOSI  (via drill 0.7 pad 0.61)
  Top 0.254: JP16.1 30.24,7.11 30.24,12.57 v28.09,14.73
  Bottom 0.254: 32.4,22.54 IC5.21 32.43,21.36 31.9,20.83 30.12,20.83 27.2,17.91 27.2,15.62 v28.09,14.73
ALED_SCK  (via drill 0.7 pad 0.61)
  Top 0.254: JP17.1 31.39,3.3 31.58,3.49 31.58,5.46 31.39,5.65 30.75,5.65 30.75,13.34 v29.36,14.73
  Bottom 0.254: IC5.22 33.17,22.5 33.17,21.34 32.15,20.32 30.37,20.32 27.7,17.65 27.7,16.38 v29.36,14.73
CVIN0  (via drill 0.6, 0.7 pad 0.61)
  Top 0.254: v46.25,28.96 46.63,29.34 46.63,30.86 47.77,32 52.22,32 52.77,32.56 v52.77,32.89
  Bottom 0.254: R22.2 46.88,27.49 47.14,27.75 47.14,28.96 | IC3.4 56.62,33.74 55.77,32.89 v52.77,32.89 | 47.26,27.24 R22.2 | 47.14,28.96 v46.25,28.96 | 47.14,28.96 IC4.7 | A.TP 47.26,27.11 R22.2
CVIN1  (via drill 0.6)
  Top 0.254: v47.26,36.58 52.34,36.58 52.72,36.2 v54.76,36.2
  Bottom 0.254: R21.2 47.2,36.64 v47.26,36.58 IC4.1 49.17,36.9 B.TP | IC3.3 56.56,34.39 v54.76,36.2
CVIN2
  Bottom 0.254: R20.2 61.55,28.38 60.98,28.96 IC2.8 59.14,28.96 | IC3.6 58.13,32.44 58.31,32.26 58.31,29.21 58.57,28.96 59.14,28.96 | C.TP 59.14,28.96
CVIN3
  Bottom 0.254: IC3.5 58,33.09 58.31,33.4 58.31,36.2 58.69,36.58 IC2.14 61.23,36.58 61.74,37.08 61.74,38.17 R19.2 61.49,38.42 D.TP
CVOUTA
  Bottom 0.254: IC1.3 92.09,35.05 91.59,34.54 91.59,29.21 92.6,28.19 95.27,28.19 96.54,26.92 96.54,17.97 97.07,17.44 IC7.6
CVOUTB
  Bottom 0.254: IC1.5 92.22,32.51 92.09,32.38 92.09,29.34 92.73,28.7 95.4,28.7 97.05,27.05 97.05,20.45 98.1,19.39 IC7.3
CVOUTC
  Bottom 0.254: IC7.14 95.35,19.39 95.52,19.56 95.52,26.67 95.01,27.18 92.35,27.18 90.57,28.96 90.57,32 90.06,32.51 IC1.10
CVOUTD
  Bottom 0.254: IC1.12 90.06,35.05 91.08,34.04 91.08,29.08 92.47,27.69 95.14,27.69 96.03,26.8 96.03,19.18 94.29,17.44 IC7.11 93.45,17.4
DAC_CSEL  (via drill 0.6)
  Top 0.254: v83.08,2.03 81.36,2.03 80.6,1.27 50.44,1.27 49.29,2.41 37.29,2.41 36.98,2.1 36.02,2.1 34.82,3.3 34.82,9.4 37.48,12.06 37.48,16 38.88,17.4 v38.88,18.41
  Bottom 0.254: IC7.9 94.13,16.14 95.4,14.87 95.4,11.56 85.24,1.4 83.71,1.4 v83.08,2.03 | IC5.26 35.08,18.41 v38.88,18.41
DAC_READY  (via drill 0.6)
  Top 0.254: v40.79,18.03 40.79,13.21 42.31,11.68 45.74,11.68 48.6,8.83 48.6,8.19 v48.91,7.87 | v48.15,3.56 48.91,3.56 50.69,1.78 79.39,1.78 v79.77,2.16
  Bottom 0.254: IC7.5 99.91,18.09 100.09,17.91 100.09,14.86 99.84,14.61 97.05,14.61 96.41,13.97 96.41,11.94 85.11,0.64 82.63,0.64 81.11,2.16 v79.77,2.16 | IC5.25 35.04,19.18 40.15,19.18 40.79,18.54 v40.79,18.03 | v48.15,3.56 48.15,7.11 v48.91,7.87
GND  (via drill 0.6, 0.7)
  Top 0.406: IC11.5 51.07,26.42 51.45,26.8 v53.36,26.8 | C31.- 17.67,23.5 v17.16,22.99
  Top 0.61: IC10.1 26.28,33.3 26.82,32.77 C33.- | v26.31,32 26.31,34.11 IC10.1 | IC10.1 26.28,34.52 v26.31,34.54
  Bottom 0.254: R42.1 51.26,22.29 IC11.5 | ICSP.5 7.13,1.78 JP15.1 11.13,5.91 11.13,8.45 11.39,8.7 16.4,8.7 20.08,12.38 C18.1
  Bottom 0.406: 53.49,28.51 C11.2 | C11.2 53.42,29.27 52.22,30.48 51.47,30.48 IC3.12 IC3.13 | C11.2 53.42,26.86 v53.36,26.8
  Bottom 0.61: v26.31,32 26.31,30.73 20.72,25.15 C31.- | C35.2 C34.2 24.09,37.72 25.16,37.72 26.31,36.58 v26.31,34.54
  other vias: 33.23,17.97 38.88,13.34 22.5,23.37 30.24,18.54 28.02,13.53 27.01,19.49 5.48,20.89 1.61,22.92
  pour Bottom: 0.08,25.15 -0.05,0.06 33.36,0.13 33.48,12.06 52.79,12.13 52.72,12.83 52.85,25.02
  pour Top: 0.08,24.32 52.09,24.38 52.09,12.95 33.04,12.95 33.04,0.25 0.02,0.13 0.02,24.26
KEY0
  Bottom 0.254: IC5.41 27.63,9.89 26.31,8.57 20.4,8.57 18.81,6.99 JP2.1
KEY1
  Bottom 0.254: IC5.40 28.43,10 26.5,8.06 20.59,8.06 20.08,7.56 20.08,4.57 JP3.1
KEY2
  Bottom 0.254: IC5.39 29.23,10.1 26.69,7.56 21.74,7.56 21.35,7.18 JP4.1
KEY3
  Bottom 0.254: JP5.1 22.62,4.57 22.62,6.48 23.2,7.05 26.88,7.05 30.03,10.2 IC5.38
KEY4  (via drill 0.6)
  Top 0.254: v28.66,7.75 25.8,7.75 JP6.1
  Bottom 0.254: IC5.37 30.83,9.47 29.1,7.75 v28.66,7.75
KEY5
  Bottom 0.254: JP7.1 25.16,4.57 29.67,4.57 30.24,5.14 30.24,8.19 31.63,9.58 IC5.36
KEY6  (via drill 0.6)
  Top 0.254: JP8.1 26.43,5.78 27.64,4.57 v30.75,4.57
  Bottom 0.254: IC5.35 32.4,10.94 32.4,5.14 31.83,4.57 v30.75,4.57
KEY7
  Bottom 0.254: IC5.34 33.23,2.98 31.77,1.52 27.39,1.52 26.43,2.48 JP9.1
KEY8
  Bottom 0.254: IC5.3 22.51,14.36 22.24,14.1 22.24,11.11 17.54,6.41 17.54,4.57 JP10.1
KEY9
  Bottom 0.254: IC5.4 22.42,15.16 21.74,14.48 21.74,11.3 JP11.1
KEY10  (via drill 0.7 pad 0.61)
  Top 0.254: v19.07,20.95 18.56,20.95 15.64,18.03 10.18,18.03 9.99,17.84 9.99,9.78 12.08,7.68 12.31,7.46 13.73,6.03 JP12.1
  Bottom 0.254: v19.07,20.95 20.85,20.95 22.64,19.16 IC5.9
KEY11  (via drill 0.7 pad 0.61)
  Top 0.254: v20.34,22.1 18.94,22.1 15.39,18.54 9.86,18.54 9.48,18.16 9.48,9.46 11.45,7.49 11.89,7.05 12.46,6.48 12.46,4.57 JP13.1
  Bottom 0.254: 23.4,19.94 IC5.10 22.47,19.96 v20.34,22.1
MCUADC1
  Bottom 0.254: IC5.19 30.83,24.69 29.36,26.16 29.36,27.81 28.34,28.83 25.55,28.83 21.1,24.38 18.81,24.38 18.43,24 11.7,24 11.45,23.75 POT1.W | G.TP C16.1 11.45,18.8 11.45,20.45
  Bottom 0.406: 11.45,20.45 POT1.W
MCUADC2  (via drill 0.6)
  Top 0.254: v48.28,1.02 34.5,1.02 33.93,1.59 33.93,9.21 36.53,11.81 36.53,12.83 34.63,14.73 30.94,14.73 30.5,15.18 30.5,17.02 29.04,18.48 v29.04,21.02
  Bottom 0.254: R36.2 54.19,1.52 F.TP IC6.7 48.79,1.52 v48.28,1.02 | IC5.15 27.63,21.41 28.02,21.02 v29.04,21.02
MCUADC3  (via drill 0.6)
  Top 0.254: v49.42,9.14 46.37,12.19 42.56,12.19 41.67,13.08 v41.67,22.61 | v26.82,21.08 26.31,21.59 26.31,24.13 28.47,26.29 32.91,26.29 v34.31,24.89
  Bottom 0.254: IC6.1 52.92,9.14 R34.2 | IC6.1 v49.42,9.14 | IC5.14 26.82,22.55 v26.82,21.08 | v34.31,24.89 40.53,24.89 41.67,23.75 v41.67,22.61 | E.TP 51.01,9.28 IC6.1
MIDI_IN  (via drill 0.6)
  Top 0.254: v47.26,19.68 47.9,19.68 48.53,20.32 IC11.6
  Bottom 0.254: v47.26,19.68 46.63,20.32 R43.2 45.61,20.13 45.61,19.68 44.72,18.8 41.67,18.8 39.71,20.76 IC5.23
N$1
  Bottom 0.254: IC1.2 92.09,36.32 91.97,36.45 91.97,39.12 92.35,39.5 103.78,39.5 104.03,39.24 104.03,38.41 104.16,38.29 | R2.1 104.16,38.29 | 104.16,38.29 R1.2
N$2  (via drill 0.6)
  Top 0.254: v103.65,33.91 105.05,32.51 106.7,32.51 107.21,32 107.21,10.92 104.79,8.51 94.38,8.51 94.08,8.81 OUT4.P$1
  Bottom 0.254: R2.2 R3.2 C1.2 97.81,35.18 102.38,35.18 v103.65,33.91
N$3
  Bottom 0.61: D1.A 11.07,32.13 8.78,32.13 8.53,32.38 F1.1
N$4
  Bottom 0.254: IC1.1 95.14,37.59 95.84,38.29 C1.1 R3.1
N$5
  Bottom 0.254: R25.1 35,38.29 34.18,37.46 34.18,26.16 34.94,25.4 59.33,25.4 61.23,23.5 61.23,16.76 63.65,14.35 63.65,12.19 66.06,9.78 66.06,6.86 64.96,5.76 IN1.P$1
N$6  (via drill 0.6)
  Top 0.254: v96.03,31.24 102.13,31.24 v104.16,29.21
  Bottom 0.254: R5.1 102.95,29.21 v104.16,29.21 105.37,29.21 R4.2 105.43,29.46 | IC1.6 v96.03,31.24
N$7
  Bottom 0.254: R5.2 R6.2 C2.2 97.81,32.26 98.06,32.51 106.7,32.51 107.21,32 107.21,2.03 106.7,1.52 95.65,1.52 94.13,3.05 94.13,4.78 OUT3.P$1
N$8
  Bottom 0.254: R6.1 C2.1 96.22,29.28 95.52,29.97 IC1.7
N$9
  Bottom 0.61: D2.C 10.81,28.96 10.56,29.21 8.65,29.21 8.53,29.08 F2.1
N$10
  Bottom 0.254: R28.1 35.58,26.16 35.83,25.91 59.71,25.91 61.87,23.75 61.87,17.06 IN2.P$1
N$11
  Bottom 0.254: R11.1 R12.2 | R11.1 78.31,29.28 78.25,29.34 | IC1.9 89.93,31.24 90.06,31.12 90.06,29.08 89.17,28.19 80.6,28.19 R11.1
N$12  (via drill 0.7)
  Top 0.254: OUT1.P$1 91.89,10.88 v91.46,11.3 | v79.52,32.26 79.52,28.19 80.16,27.56 84.6,27.56 v85.36,26.8
  Bottom 0.254: C6.2 R10.2 R11.2 v79.52,32.26 | v91.46,11.3 88.41,11.3 84.6,15.11 84.6,20.57 85.36,21.34 v85.36,26.8
N$13
  Bottom 0.254: R10.1 C6.1 85.42,29.34 86.38,29.34 87.01,29.97 IC1.8
N$14
  Top 0.61: PWR.1 PWR.2
  Bottom 0.254: 8.4,35.81 F1.2
  Bottom 0.61: PWR.1 PWR.2 8.4,35.81
N$15
  Bottom 0.254: 40.91,30.48 41.42,30.48 42.44,30.48 42.69,30.23 IC4.9 | R26.1 40.91,30.48 | R28.2 35.58,29.97 36.09,30.48 40.91,30.48
N$16  (via drill 0.6)
  Top 0.254: v90.82,37.72 90.82,37.85 90.57,38.1 78.5,38.1 v78.25,37.85
  Bottom 0.254: R9.2 77.42,37.85 v78.25,37.85 79.52,37.85 80.03,38.35 79.59,38.35 R8.1 | v90.82,37.72 90.82,36.58 90.57,36.32 IC1.13
N$17  (via drill 0.7)
  Top 0.254: v82.06,35.18 82.06,28.45 82.31,28.19 85.36,28.19 v86.76,26.8
  Bottom 0.254: R8.2 R7.2 82.57,36.39 | 82.57,36.39 C4.2 | OUT2.P$1 86.63,13.97 85.11,15.49 85.11,20.45 85.87,21.21 85.87,25.91 v86.76,26.8 | v82.06,35.18 82.06,35.88 82.57,36.39
N$18
  Bottom 0.254: R7.1 C4.1 86.44,38.29 87.14,37.59 IC1.14
N$19
  Top 0.61: PWR.10 PWR.9 1.29,25.65
  Bottom 0.61: PWR.9 PWR.10 8.4,25.65 F2.2
N$20
  Bottom 0.254: R27.1 R26.2 42.25,27.24 42.44,27.43 42.44,28.45 42.94,28.96 IC4.8
N$21  (via drill 0.6)
  Top 0.254: v43.2,27.94 41.67,29.46 v38.37,29.46
  Bottom 0.254: v38.37,29.46 R27.2 | IC4.6 45.61,30.23 45.3,29.91 R22.1 43.96,27.18 v43.2,27.94
N$22
  Bottom 0.254: IC5.12 25.23,23.56 PB5.TP
N$23
  Bottom 0.254: IC11.7 48.15,20.32 R42.2
N$24  (via drill 0.6)
  Top 0.254: MIDI.R 86.25,23.11 82.7,19.56 78.57,19.56 v78.5,19.49
  Bottom 0.254: R31.2 v78.5,19.49 R30.1 | R31.2 76.79,19.49 76.73,19.56 77.17,19.56 R31.2
N$25
  Bottom 0.254: R25.2 35.83,35.56 36.34,35.05 40.91,35.05 | IC4.13 42.44,35.31 42.18,35.05 40.91,35.05 | R23.1 40.91,35.05
N$26
  Bottom 0.254: R24.1 R23.2 41.74,38.29 42.44,37.59 42.44,36.83 42.69,36.58 | IC4.14 42.69,36.58 | 42.69,36.58 42.62,36.58
N$27  (via drill 0.6)
  Top 0.254: v43.45,37.59 43.45,36.58 42.94,36.07 v38.37,36.07
  Bottom 0.254: R24.2 v38.37,36.07 | IC4.2 47.26,35.31 45.3,37.27 R21.1 43.71,38.35 43.45,38.1 v43.45,37.59
N$28
  Bottom 0.254: R32.2 74.57,20.83 74.95,21.21 80.41,21.21 80.48,21.21 | 80.48,21.21 MIDI.T | R29.1 81.81,20.57 81.17,21.21 80.48,21.21
N$29  (via drill 0.6)
  Top 0.254: IC11.3 48.53,13.34 51.2,10.67 76.54,10.67 v77.23,11.37
  Bottom 0.254: R31.1 R32.1 77.04,17.59 77.23,17.4 v77.23,11.37 | IC11.3 48.53,16.86 D3.C
N$30
  Bottom 0.254: IN5.P$1 67.15,20.65 72.92,26.42 R16.1
N$31
  Bottom 0.254: R16.2 72.92,29.46 71.39,30.99 69.68,30.99 R18.1 66.75,30.23 IC2.6
N$32
  Bottom 0.254: R17.1 R18.2 67.77,27.18 66.95,27.18 65.17,28.96 IC2.7
N$33  (via drill 0.6)
  Top 0.254: v65.55,27.18 68.41,27.18 R17.2 v70.38,29.97
  Bottom 0.254: v65.55,27.18 63.52,27.18 63.45,27.24 R20.1 63.01,27.62 63.01,27.94 60.72,30.23 IC2.9 | v70.38,29.97 R17.2
N$34  (via drill 0.6)
  Top 0.254: v39.13,11.56 40.91,11.56 41.86,10.61 45.29,10.61 47.26,8.64 v47.26,7.87
  Bottom 0.254: IC6.13 v47.26,7.87 | R39.2 R38.1 38.18,9.9 38.18,11.3 38.44,11.56 v39.13,11.56
N$35
  Bottom 0.254: R37.1 C21.1 44.98,9.84 IC6.14
N$36
  Bottom 0.254: R13.1 74.13,38.29 74.44,37.97 74.44,35.18 74.95,34.67 74.95,28.19 75.46,27.69 75.46,26.42 74.82,25.78 73.04,25.78 67.84,20.57 67.84,15.11 68.47,14.48 68.47,13.34 67.15,12.02 IN4.P$1 67.2,4.87
N$37
  Bottom 0.254: IC2.2 66.31,35.31 66.57,35.05 67.84,35.05 | 67.84,35.05 72.66,35.05 72.92,35.31 R13.2 | R15.1 67.84,35.05
N$38
  Bottom 0.254: IC2.1 66.31,36.58 66.31,37.59 67.01,38.29 R15.2 R14.1
N$39  (via drill 0.6)
  Top 0.254: v70.38,36.07 v62.25,36.07
  Bottom 0.254: IC2.13 61.49,35.31 v62.25,36.07 63.52,37.34 63.52,38.29 R19.1 | v70.38,36.07 R14.2
N$40  (via drill 0.6)
  Top 0.254: TRIG.P$1 94.08,22.43 90.32,18.67 90.32,1.4 89.68,0.76 50.18,0.76 48.98,1.97 37.61,1.97 37.23,1.59 35.26,1.59 v34.82,2.03
  Bottom 0.254: C21.2 R37.2 R38.2 38.12,6.22 34.82,2.92 v34.82,2.03
N$41  (via drill 0.6)
  Top 0.254: IC11.2 45.99,13.34 49.17,10.16 77.36,10.16 v78.63,11.43
  Bottom 0.254: R30.2 R29.2 81.81,12.76 80.47,11.43 v78.63,11.43 | IC11.2 D3.A
N$42
  Bottom 0.254: R41.1 R40.2 43.07,3.36 C22.1 43.77,4.06 IC6.10
N$43
  Bottom 0.254: IC6.2 51.83,7.87 52.47,8.51 55.14,8.51 | 55.14,8.51 57.93,8.51 58.06,8.64 58.06,9.59 R33.2 | R34.1 55.32,8.7 55.14,8.51
N$44
  Bottom 0.254: C27.1 IC8.1
N$45  (via drill 0.6)
  Top 0.254: v69.36,17.53 64.92,21.97 64.92,23.07 IN3.P$1 | v64.66,7.24 v68.09,7.24
  Bottom 0.254: R33.1 62.12,9.65 64.53,7.24 v64.66,7.24 | v69.36,17.53 70.76,16.13 70.76,8.64 69.36,7.24 v68.09,7.24
N$47
  Bottom 0.254: IC6.6 51.83,2.79 52.47,3.43 56.6,3.43 | R35.2 58.89,3.43 56.6,3.43 | R36.1 56.59,3.43 56.6,3.43
N$48
  Bottom 0.254: IC5.16 28.43,23.28 25.74,25.97 PD7.TP
N$49  (via drill 0.6)
  Top 0.254: v71.27,17.65 67.2,21.72 67.2,23.07 IN6.P$1
  Bottom 0.254: R35.1 68.09,3.56 71.27,6.73 v71.27,17.65
N$51
  Bottom 0.254: IC5.17 29.23,24.13 PD6.TP
N$52
  Bottom 0.254: IC5.18 30.03,24.85 28.34,26.54 PD5.TP
N$58
  Bottom 0.254: IC5.13 26.03,23.52 24.66,24.89 PB4.TP
OFFSET
  Bottom 0.254: IC6.8 IC6.9 48.91,2.79 49.17,3.05 49.17,4.06 | 49.17,4.06 49.17,6.35 49.42,6.6 IC6.3 | IC6.5 49.17,4.06
RESET#  (via drill 0.6)
  Top 0.254: v15.26,10.54 v23.77,10.54
  Bottom 0.254: v15.26,10.54 7.26,10.54 5.67,8.95 5.67,7.43 5.1,6.86 ICSP.3 | IC5.43 26.05,10.94 26.05,10.03 25.8,9.78 24.53,9.78 v23.77,10.54
SCL  (via drill 0.6)
  Top 0.254: v10.88,13.59 10.88,14.86 12.97,16.95 19.32,16.95 22.88,13.4 v26.56,13.4
  Bottom 0.254: IC5.32 33.46,13.56 32.66,12.76 27.2,12.76 v26.56,13.4 | IC12.1 5.62,21.83 7.45,20 7.45,17.91 10.31,15.05 10.56,15.05 R45.1 v10.88,13.59
SDA  (via drill 0.6)
  Top 0.254: v13.16,13.59 13.16,15.88 13.73,16.45 19.13,16.45 23.01,12.57 v25.8,12.57
  Bottom 0.254: IC5.33 33.29,12.76 32.85,12.32 26.05,12.32 v25.8,12.57 | IC12.3 6.86,19.95 7,19.81 7,17.65 9.48,15.18 9.48,13.14 9.86,12.76 12.91,12.76 13.16,13.02 v13.16,13.59 R46.1
SPI_CLK  (via drill 0.6)
  Top 0.254: v91.84,16.89 91.84,18.92 95.27,22.35 95.27,25.02 94.25,25.02 93.49,25.78 93.49,32.26 93.24,32.51 89.55,32.51 88.79,33.27 88.79,35.94 88.66,36.07 80.16,36.07 79.65,35.56 77.11,35.56 75.84,34.29 73.68,34.29 70.25,30.86 64.15,30.86 63.52,30.23 57.68,30.23 | v25.8,17.65 25.8,24.38 28.21,26.8 33.17,26.8 33.93,26.04 46.75,26.04 48.15,27.43 48.15,30.1 48.53,30.48 54.76,30.48 55.14,30.86 57.04,30.86 57.68,30.23 | v57.3,28.96 57.68,29.34 57.68,30.23
  Bottom 0.254: IC7.10 91.94,16.79 v91.84,16.89 | IC5.2 24.5,13.56 25.8,14.86 v25.8,17.65 | IC3.10 v57.3,28.96
SPI_MISO  (via drill 0.6)
  Top 0.254: v51.45,29.08 51.07,29.46 49.17,29.46 49.17,26.92 47.14,24.89 41.55,24.89 37.99,21.34 37.99,17.27 36.59,15.88 v36.59,14.35
  Bottom 0.254: IC3.11 v51.45,29.08 | 35.02,14.35 IC5.31 35.04,14.35 v36.59,14.35
SPI_MOSI  (via drill 0.6)
  Top 0.254: v95.14,16.89 95.14,20.19 95.78,20.83 95.78,25.4 95.65,25.53 94.38,25.53 94,25.91 94,32.51 93.49,33.02 89.68,33.02 89.3,33.4 89.3,36.2 88.92,36.58 80.03,36.58 79.52,36.07 76.98,36.07 75.71,34.8 73.55,34.8 70.12,31.37 63.9,31.37 63.52,30.99 62.38,30.99 62.12,31.24 60.72,31.24 60.47,31.5 54.5,31.5 v54.25,31.24 53.99,30.99 48.28,30.99 47.64,30.35 47.64,27.69 46.5,26.54 34.05,26.54 33.29,27.3 27.96,27.3 25.04,24.38 v25.04,18.54
  Bottom 0.254: IC7.8 99.16,15.45 98.95,15.24 95.9,15.24 95.14,16 v95.14,16.89 | IC5.1 24.47,12.76 26.69,14.99 26.69,18.03 26.18,18.54 v25.04,18.54 | IC3.8 57.27,31.12 56.79,31.12 56.66,31.24 v54.25,31.24
SWD_CLK  (via drill 0.6)
  Top 0.254: v16.15,9.78 v23.01,9.78
  Bottom 0.254: v16.15,9.78 7.38,9.78 6.37,8.76 6.37,5.33 5.35,4.32 ICSP.4 | IC5.42 26.82,10.95 26.82,9.78 26.18,9.14 23.64,9.14 v23.01,9.78
SWD_DIO  (via drill 0.6)
  Top 0.254: v24.53,11.3 v14.37,11.3
  Bottom 0.254: v14.37,11.3 7.13,11.3 5.23,9.4 ICSP.2 | v24.53,11.3 25.04,11.3 25.29,11.56 25.29,11.03 IC5.44
TRGOUT  (via drill 0.6)
  Top 0.254: v40.02,22.1 40.02,13.21 42.06,11.18 45.48,11.18 48.02,8.64 48.02,7.37 v47.26,6.6
  Bottom 0.254: IC6.12 v47.26,6.6 | 31.64,22.99 31.64,22.8 31.51,22.68 IC5.20 31.63,23.23 31.64,23.24 31.64,23.62 32.15,24.13 39.39,24.13 40.02,23.5 v40.02,22.1
VDD  (via drill 0.6, 0.7)
  Top 0.406: v94.76,26.29 95.9,26.29 96.28,25.91 96.28,21.21 97.36,20.07 v97.36,18.8 | v91.97,26.29 89.55,26.29 88.28,25.02 84.35,25.02 83.08,26.29 76.85,26.29 75.2,27.94 70.12,27.94 68.47,26.29 65.04,26.29 64.53,26.8 64.53,27.43 64.03,27.94 55.52,27.94 | v43.45,16.76 48.91,16.76 49.8,17.65 49.8,27.3 50.44,27.94 55.52,27.94 | v55.39,26.8 55.39,27.81 55.52,27.94
  Top 0.61: C33.+ 25.04,30.73 v24.02,31.75 24.02,34.11 IC10.2 24,34.31 v24.02,34.42 | 20.85,24.89 15.13,19.18 4.27,19.18 2.49,17.4 ICSP.1 3.51,11.94 7.32,8.13 7.32,3.94 7.96,3.3 JP14.1 | v20.85,28.58 20.85,24.89 | 20.85,24.89 23.39,24.89 23.89,24.38 23.89,16.6 24.53,15.96 25,15.96 v25.04,16 28.09,16 v28.85,16.76 | v43.45,16.76 IC11.8
  Bottom 0.254: 51.5,31.75 IC3.14 | R43.1 43.52,22.41 IC11.8 | IC7.4 100.02,18.74 100.6,18.16 100.6,16.64 100.98,16.26 C26.1 | IC5.5 21.38,15.96 C18.2 | v28.85,16.76 IC5.28 38.82,16.76 C19.1
  Bottom 0.406: v55.39,26.8 55.39,28.38 C11.1 54.88,28.89 54.88,29.08 52.17,31.79 IC3.14 IC3.15 | v91.97,26.29 v94.76,26.29 | IC7.4 97.99,18.74 v97.36,18.8 | 19.9,14.67 C18.2
  Bottom 0.61: C34.1 v24.02,34.42 | v24.02,31.75 v20.85,28.58 | v28.85,16.76 v43.45,16.76 | IC5.5 25,15.96 v25.04,16
VIN+  (via drill 0.7)
  Top 0.61: v21.74,34.54 21.71,34.52 IC10.3 21.68,34.16 19.83,34.16 19.45,33.78 19.45,28.19 18.43,27.18 C31.+
  Bottom 0.61: C35.1 v21.74,34.54 21.35,34.16 16.02,34.16 14.79,35.39 L1.1 13.1,35.94 12.59,36.45 11.12,36.45 D1.C
VIN-
  Bottom 0.61: D2.A 12.52,25.07 12.85,25.4 L2.1

### Text on the board
bDocu: hotchk155 | cv quantizer main v1